# Altium project WLC_LCD176X220_PID.PrjPcb
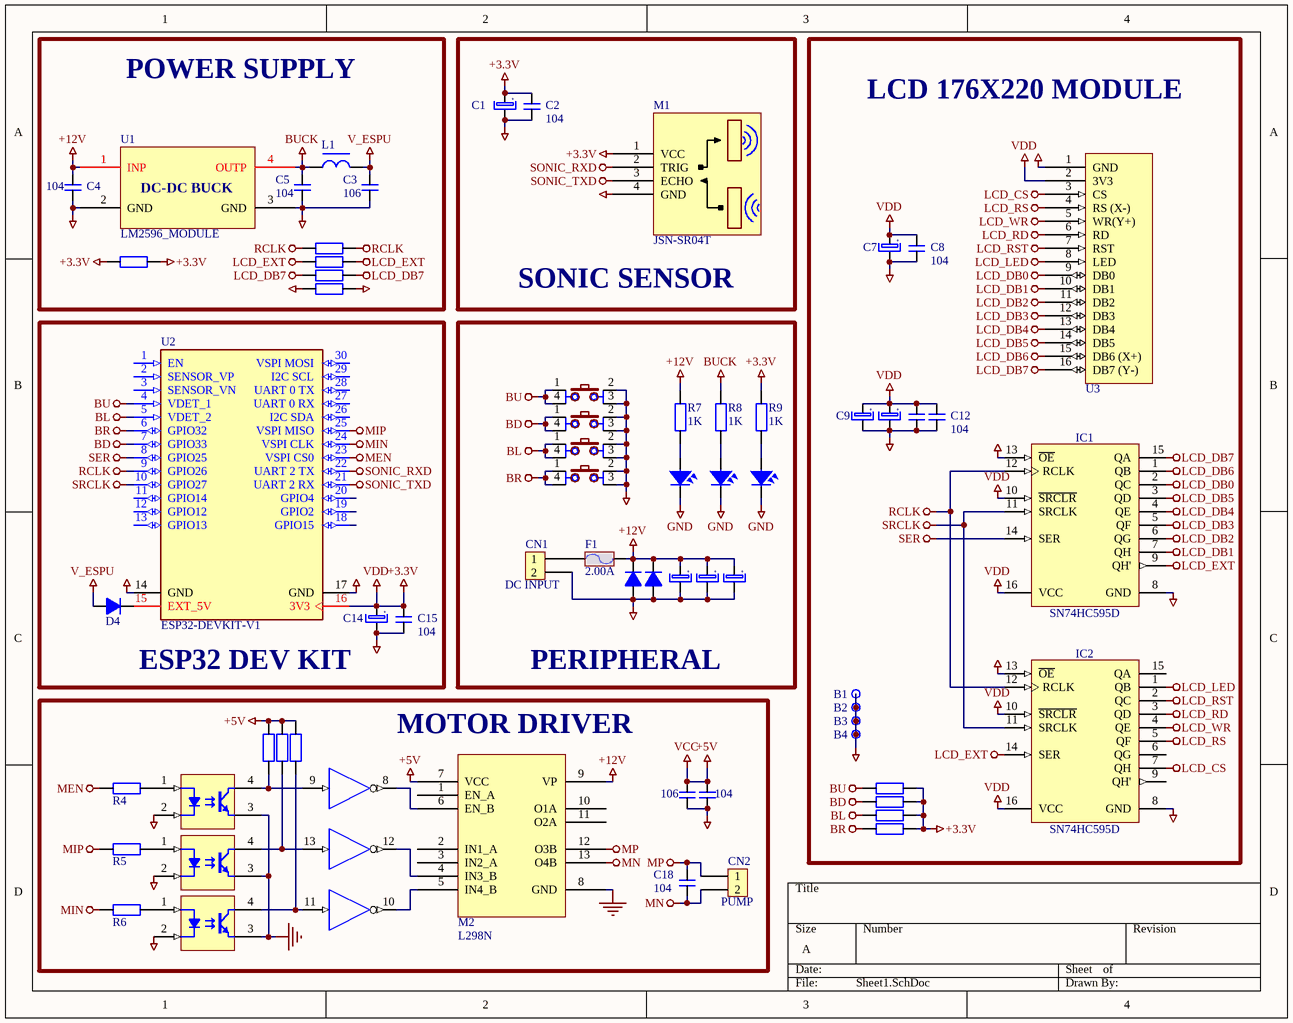
[diagram p0: Sheet1.SchDoc]
1 sheet, 66 parts. Net scope: global (net labels, ports and power ports of the same name join across sheets).
Board file: PCB1.PcbDoc

## Sheet Sheet1.SchDoc
size A

### Parts
B1  Plated Hole  [MTG300_600]  (value not drawn)
B2  Plated Hole  [MTG300_600]  (value not drawn)
B3  Plated Hole  [MTG300_600]  (value not drawn)
B4  Plated Hole  [MTG300_600]  (value not drawn)
C1  220uF  [Cap-P-2.5/5]  (value not drawn)
C2  104  [Cap-Non-150mil]
C3  106  [CAP-SMD-0805]
C4  104  [Cap-Non-150mil]
C5  104  [Cap-Non-150mil]
C6  470uF  [Cap-P-3.8/6.3]  (value not drawn)
C7  220uF  [Cap-P-2.5/5]  (value not drawn)
C8  104  [Cap-Non-150mil]
C9  220uF  [Cap-P-2.5/5]  (value not drawn)
C10  220uF  [Cap-P-2.5/5]  (value not drawn)
C11  104  [Cap-Non-150mil]  (value not drawn)
C12  104  [Cap-Non-150mil]
C13  470uF  [Cap-P-3.8/6.3]  (value not drawn)
C14  220uF  [Cap-P-2.5/5]  (value not drawn)
C15  104  [Cap-Non-150mil]
C16  106  [CAP-SMD-0805]
C17  104  [CAP-SMD-0805]
C18  104  [CAP-SMD-0805]
C19  470uF  [Cap-P-3.8/6.3]  (value not drawn)
CN1  DC INPUT  [KF2/5.08]
CN2  PUMP  [KF2/5.08]
D1  SS14  [SOD 106]  (value not drawn)
D2  SS14  [SOD 106]  (value not drawn)
D4  SS14  [SOD 106]  (value not drawn)
F1  2.00A  [Fuse-Dip1]
IC1  SN74HC595D  [SOIC127P600X175-16N]
IC2  SN74HC595D  [SOIC127P600X175-16N]
IC3  FOD817DSD  [DIP4]  (value not drawn)
IC4  FOD817DSD  [DIP4]  (value not drawn)
IC5  FOD817DSD  [DIP4]  (value not drawn)
IC6  74HC14D  [SOIC127P600X175-14N]  (value not drawn)  (parts D,E,F of 6)
L1  470uH  [L-DIP-M-5.3]  (value not drawn)
LED1  POWER  [LED-0805]  (value not drawn)
LED2  ESP-5.0V  [LED-0805]  (value not drawn)
LED3  ESP-3.3V  [LED-0805]  (value not drawn)
M1  JSN-SR04T  [JSN-SR04T]
M2  L298N  [L298N_MODULE]
R1  1K  [RES-SMD-0805]  (value not drawn)
R2  1K  [RES-SMD-0805]  (value not drawn)
R3  1K  [RES-SMD-0805]  (value not drawn)
R4  1K  [RES-SMD-0805]  (value not drawn)
R5  1K  [RES-SMD-0805]  (value not drawn)
R6  1K  [RES-SMD-0805]  (value not drawn)
R7  1K  [RES-SMD-0805]
R8  1K  [RES-SMD-0805]
R9  1K  [RES-SMD-0805]
R13  0R  [RES-SMD-0805]  (value not drawn)
R14  0R  [RES-SMD-0805]  (value not drawn)
R15  0R  [RES-SMD-0805]  (value not drawn)
R16  0R  [RES-SMD-1206]  (value not drawn)
R21  1K  [RES-SMD-0805]  (value not drawn)
R22  1K  [RES-SMD-0805]  (value not drawn)
R23  1K  [RES-SMD-0805]  (value not drawn)
R24  1K  [RES-SMD-0805]  (value not drawn)
R27  0R  [RES-SMD-1206]  (value not drawn)
SW1  UP  [Button-Dip4/6x6]  (value not drawn)
SW2  DOWN  [Button-Dip4/6x6]  (value not drawn)
SW3  LEFT  [Button-Dip4/6x6]  (value not drawn)
SW4  RIGHT  [Button-Dip4/6x6]  (value not drawn)
U1  LM2596_MODULE  [LM2596_MODULE]
U2  ESP32-DEVKIT-V1  [MODULE_ESP32-DEVKITC-32D]
U3  ST7775R_2.0  [LCD_176X220_MODULE]  (value not drawn)

### Blocks framed on the sheet
POWER SUPPLY: C3-C5 L1 R13-R16 R27 U1
SONIC SENSOR: C1 C2 M1
LCD 176X220 MODULE: B1-B4 C7-C12 IC1 IC2 R21-R24 U3
ESP32 DEV KIT: C14 C15 D4 U2
PERIPHERAL: C6 C13 C19 CN1 D1 D2 F1 LED1-LED3 R7-R9 SW1-SW4
MOTOR DRIVER: C16-C18 CN2 IC3-IC6 M2 R1-R6

### Nets
+3.3V: C1.1 C2.2 C7.1 C8.2 C9.1 C10.1 C11.2 C12.2 C14.1 C15.2 IC1.10(~{SRCLR}) IC1.16(VCC) IC2.10(~{SRCLR}) IC2.16(VCC) M1.1(VCC) R9.2 R21.1 R22.1 R23.1 R24.1 R27.1 R27.2 U2.16(3V3) U3.2(3V3)  [also labelled VDD]
+5V: C16.2 C17.2 IC6.14(VCC) M2.7(VCC) R1.2 R2.2 R3.2  [also labelled VCC]
+12V: C4.1 C6.1 C13.1 C19.1 D1.2(K) D2.2(K) F1.2 M2.9(VP) R7.2 U1.1(INP)
BD: R24.2 SW2.1 SW2.4 U2.7(GPIO33)
BL: R22.2 SW3.1 SW3.4 U2.5(VDET_2)
BR: R21.2 SW4.1 SW4.4 U2.6(GPIO32)
BU: R23.2 SW1.1 SW1.4 U2.4(VDET_1)
BUCK: C5.1 L1.1 R8.2 U1.4(OUTP)
GND: B1.1 B2.1 B3.1 B4.1 C1.2 C2.1 C3.1 C4.2 C5.2 C6.2 C7.2 C8.1 C9.2 C10.2 C11.1 C12.1 C13.2 C14.2 C15.1 C16.1 C17.1 C19.2 CN1.2 D1.1(A) D2.1(A) IC1.8(GND) IC1.13(~{OE}) IC2.8(GND) IC2.13(~{OE}) IC3.2(C) IC3.3(E) IC4.2(C) IC4.3(E) IC5.2(C) IC5.3(E) IC6.7(GND) LED1.2 LED2.2 LED3.2 M1.4(GND) M2.8(GND) R16.1 R16.2 SW1.2 SW1.3 SW2.2 SW2.3 SW3.2 SW3.3 SW4.2 SW4.3 U1.2(GND) U1.3(GND) U2.14(GND) U2.17(GND) U3.1(GND)
LCD_CS: IC2.7(QH) U3.3(CS)
LCD_DB0: IC1.2(QC) U3.9(DB0)
LCD_DB1: IC1.7(QH) U3.10(DB1)
LCD_DB2: IC1.6(QG) U3.11(DB2)
LCD_DB3: IC1.5(QF) U3.12(DB3)
LCD_DB4: IC1.4(QE) U3.13(DB4)
LCD_DB5: IC1.3(QD) U3.14(DB5)
LCD_DB6: IC1.1(QB) U3.15(DB6_(X+))
LCD_DB7: IC1.15(QA) R15.1 R15.2 U3.16(DB7_(Y-))
LCD_EXT: IC1.9(QH') IC2.14(SER) R14.1 R14.2
LCD_LED: IC2.1(QB) U3.8(LED)
LCD_RD: IC2.3(QD) U3.6(RD)
LCD_RS: IC2.5(QF) U3.4(RS_(X-))
LCD_RST: IC2.2(QC) U3.7(RST)
LCD_WR: IC2.4(QE) U3.5(WR(Y+))
MEN: R4.2 U2.23(VSPI_CS0)
MIN: R6.2 U2.24(VSPI_CLK)
MIP: R5.2 U2.25(VSPI_MISO)
MN: C18.1 CN2.2 M2.13(O4B)
MP: C18.2 CN2.1 M2.12(O3B)
RCLK: IC1.12(RCLK) IC2.12(RCLK) R13.1 R13.2 U2.9(GPIO26)
SER: IC1.14(SER) U2.8(GPIO25)
SONIC_RXD: M1.2(TRIG) U2.22(UART_2_TX)
SONIC_TXD: M1.3(ECHO) U2.21(UART_2_RX)
SRCLK: IC1.11(SRCLK) IC2.11(SRCLK) U2.10(GPIO27)
V_ESPU: C3.2 D4.1(A) L1.2
NetCN1_1: CN1.1 F1.1
NetD4_2: D4.2(K) U2.15(EXT_5V)
NetIC3_1: IC3.1(A) R4.1
NetIC3_4: IC3.4(C) IC6.9(IN) R1.1
NetIC4_1: IC4.1(A) R6.1
NetIC4_4: IC4.4(C) IC6.11(IN) R3.1
NetIC5_1: IC5.1(A) R5.1
NetIC5_4: IC5.4(C) IC6.13(IN) R2.1
NetIC6_8: IC6.8(OUT) M2.6(EN_B)
NetIC6_10: IC6.10(OUT) M2.5(IN4_B)
NetIC6_12: IC6.12(OUT) M2.4(IN3_B)
NetLED1_1: LED1.1 R7.1
NetLED2_1: LED2.1 R8.1
NetLED3_1: LED3.1 R9.1

Not connected (* = marked no-connect by the designer): IC2 6(QG) 9(QH') 15(QA); M2 1(EN_A) 2(IN1_A) 3(IN2_A) 10(O1A) 11(O2A); U2 1(EN) 2(SENSOR_VP) 3(SENSOR_VN) 11(GPIO14) 12(GPIO12) 13(GPIO13) 18(GPIO15) 19(GPIO2) 20(GPIO4) 26(I2C_SDA) 27(UART_0_RX) 28(UART_0_TX) 29(I2C_SCL) 30(VSPI_MOSI)

### Notes on the sheet
- (in symbol Cap-Pol-Dip) +
- (in symbol LM2596_MODULE) DC-DC BUCK

### Library data of the parts
B1-B4 = PLATED_HOLE3.0_PAD6.0: Single Terminal Socket; Part Description: Plated Through Hole: Hole Dia.=3.0mm Pad Dia.=6.0mm; Mounted: No; Part Number: PLATED_HOLE3.0_PAD6.0; Component Kind: Standard (No BOM); Component Type: Standard (No BOM); Pin Count: 1; Family: Plated Hole; Socket: No; SMD: No; Sense: No; Status: None; ComponentHeight: 0mm; HelpURL: Undefined; Author: CERN DEM JLC; CreateDate: 5/26/2008; LatestRevisionDate: 5/26/2008; PackageDescription: Plated Through Hole: Hole Dia.=3.0mm Pad Dia.=6.0mm
C1 C6 C7 C9 C10 C13 C14 C19 = Cap-Pol-Dip: Polarized capacitor
C2 C4 C5 C8 C11 C12 C15 C18 = Cap-Non-Dip: Non-polar capacitor
C3 C16 C17 = Cap-Non-SMD: Non-polar capacitor
CN1 CN2 = KF 2
D1 D2 D4 = Diode SMD
F1 = Fuse Dip
IC1 IC2 = SN74HC595D: 8-Bit Shift Register With 3-State Output Register; Part Description: 8-Bit Shift Register With 3-State Output Registers; Manufacturer: TEXAS INSTRUMENTS; PressFit: No; Bonding: No; Part Number: SN74HC595D; Component Kind: Standard; Component Type: Standard; Device: SN74HC595D; PackageDescription: SOIC 16, Pitch 1.27mm - Body 4x10mm, IPC Medium Density; Manufacturer Part Number: SN74HC595D; Pin Count: 16; Case: SOIC16; Mounted: Yes; Socket: No; SMD: Yes; Sense: No; ComponentHeight: 1.75mm; Author: CERN DEM JLC; HelpURL: \\cern.ch\dfs\Applications\Altium\Datasheets\SN74HC595D.pdf; CreateDate: 6/5/2012; LatestRevisionDate: 6/5/2012
IC3-IC5 = FOD817DSD: Single Optocoupler; Part Description: 4-Pin High Operating Temperature Phototransistor Optocoupler; Manufacturer: FAIRCHILD SEMICONDUCTOR; PressFit: No; Bonding: No; Part Number: FOD817DSD; Component Kind: Standard; Component Type: Standard; Device: FOD817DSD; Footprint: FAIRCHILD_FOD817DSD; PackageDescription: SOIC, 2.54mm Pitch, 4 Pin, Body 6.5mm W X 4.6mm L X 4.6mm H; Manufacturer Part Number: FOD817DSD; Pin Count: 4; Case: SOIC4; Mounted: Yes; Socket: No; SMD: Yes; Sense: No; ComponentHeight: 4.6mm; HelpURL: \\cern.ch\dfs\Applications\Altium\Datasheets\FOD817DSD.pdf; Author: CERN DEM JLC; CreateDate: 7/21/2014; LatestRevisionDate: 7/21/2014
IC6 = 74HC14D: Hex Schmitt-Trigger Inverter; Part Description: Hex  Inverterting Schmitt-Trigger; Manufacturer: NXP SEMICONDUCTORS; PressFit: No; Bonding: No; Part Number: 74HC14D; Component Kind: Standard; Component Type: Standard; Device: 74HC14D; PackageDescription: SOIC 14, Pitch 1.27mm - Body 4x8.75mm, IPC Medium Density; Manufacturer Part Number: 74HC14D; Pin Count: 14; Case: SOIC14; Mounted: Yes; Socket: No; SMD: Yes; Sense: No; ComponentHeight: 1.75mm; Author: CERN DEM JLC; HelpURL: \\cern.ch\dfs\Applications\Altium\Datasheets\74HC14D.pdf; CreateDate: 8/26/2014; LatestRevisionDate: 8/26/2014
L1 = IND-DIP-1: Inductor; Value: 150 mH
LED1-LED3 = LED_SMD
R1-R9 R21-R24 R27 = Res 1/4W: Resistor 1/4W
R13-R16 = Res SMD: Resistor SMD
SW1-SW4 = Button-4: Switch button 4 pin; Value: Button chip 4 pin
U2 = ESP32-DEVKIT-V1: - Transceiver; 802.11 b/g/n _Wi-Fi, WiFi, WLAN_, Bluetooth® Smart Ready 4.x Dual Mode For Use With ESP-WROOM-32; MF: Espressif Systems; MP: ESP32-DEVKITC-32D; Package: None; Price: None; Availability: Unavailable; SnapEDA_Link: https://www.snapeda.com/parts/ESP32-DEVKITC-32D/Espressif%20Systems/view-part/2777395/?ref=snap; Value: *
U3 = LCD_176x220_ST7775R: ComponentLink1Description: Wiki; ComponentLink1URL: http://www.lcdwiki.com/2.8inch_SPI_Module_ILI9341_SKU:MSP2807
U1 = LM2596_MODULE: ComponentLink1Description: DATASHEET; ComponentLink1URL: http://tpelectronic.ir/datasheets/20150123144301750.pdf